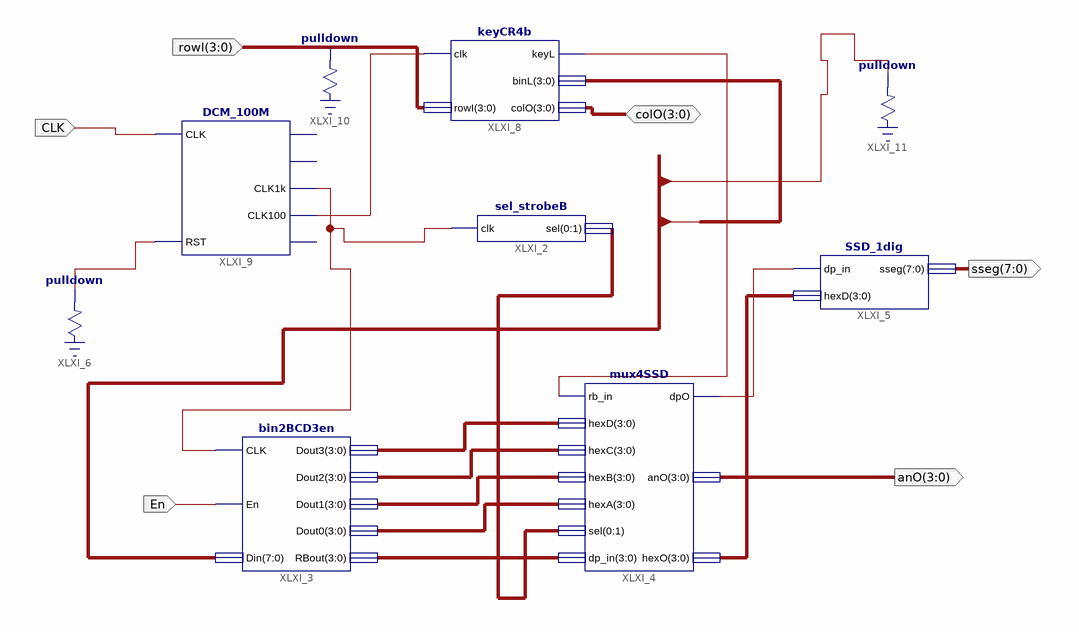
[diagram p0: schematic sheet 1]
// Xilinx ISE schematic exp4.sch (spartan3e) as structural Verilog: 9 symbols, 6 ports
module exp4 (
  input  CLK,
  input  En,
  input  [3:0] rowl,
  inout  [3:0] colO,
  output [7:0] sseg,
  output [3:0] anO
);

  wire XLXN_9, XLXN_11, XLXN_19, XLXN_30, XLXN_32, XLXN_39;
  wire [1:0] sel;
  wire [3:0] XLXN_13, XLXN_14, XLXN_15, XLXN_16, XLXN_20, XLXN_33, XLXN_38;
  wire [7:0] Din;

  sel_strobeB XLXI_2 (.clk(XLXN_9), .sel({sel[0], sel[1]}));
  bin2BCD3en XLXI_3 (
    .CLK(XLXN_9), .En(En), .Din(Din), .Dout3(XLXN_13), .Dout2(XLXN_14), .Dout1(XLXN_15), .Dout0(XLXN_16),
    .RBout(XLXN_33));
  mux4SSD XLXI_4 (
    .rb_in(XLXN_11), .hexD(XLXN_13), .hexC(XLXN_14), .hexB(XLXN_15), .hexA(XLXN_16), .sel({sel[0], sel[1]}),
    .dp_in(XLXN_33), .dpO(XLXN_19), .anO(anO), .hexO(XLXN_20));
  SSD_1dig XLXI_5 (.dp_in(XLXN_19), .hexD(XLXN_20), .sseg(sseg));
  \pulldown  XLXI_6 (.O(XLXN_30));
  keyCR4b XLXI_8 (.clk(XLXN_32), .rowI(rowl), .keyL(XLXN_11), .binL(XLXN_38), .colO(colO));
  DCM_100M XLXI_9 (.CLK(CLK), .RST(XLXN_30), .CLK1k(XLXN_9), .CLK100(XLXN_32));  // open: CLK1M, CLK10k, CLK1
  \pulldown  XLXI_10 (.O(rowl));
  \pulldown  XLXI_11 (.O(XLXN_39));
endmodule
